# EAGLE schematic Dual_Half_Bridge_With_LDO_Regulator_DRV8850 (EAGLE 6.6.0)
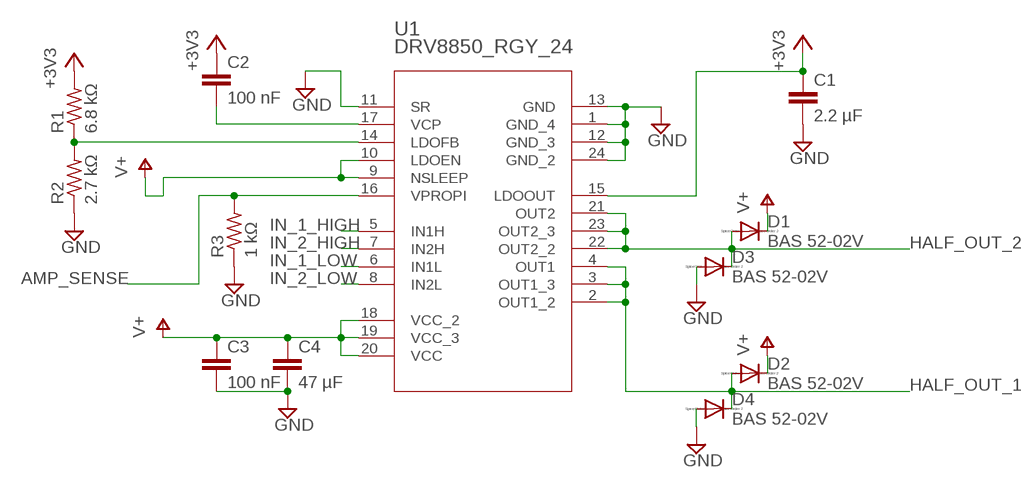
[diagram p0: schematic, sheet 1]

## Parts
C1  2.2 µF  C-EUC0603  [C0603]
C2  100 nF  C-EUC0402  [C0402]
C3  100 nF  C-EUC0402  [C0402]
C4  47 µF  C-EUC0805  [C0805]
D1  BAS 52-02V  DIODE-SOD523  [SOD523]
D2  BAS 52-02V  DIODE-SOD523  [SOD523]
D3  BAS 52-02V  DIODE-SOD523  [SOD523]
D4  BAS 52-02V  DIODE-SOD523  [SOD523]
R1  6.8 kΩ  R-US_R0402  [R0402]
R2  2.7 kΩ  R-US_R0402  [R0402]
R3  1 kΩ  R-US_R0402  [R0402]
U1  DRV8850_RGY_24  [RGY_24]

## Nets
+3V3: C1.1 C2.1 R1.2 U1.15(LDOOUT)
AMP_SENSE: R3.2 U1.16(VPROPI)
GND: C1.2 C3.2 C4.2 D3.A D4.A R2.1 R3.1 U1.1(GND_4) U1.11(SR) U1.12(GND_3) U1.13(GND) U1.24(GND_2)
HALF_OUT_1: D2.A D4.C U1.2(OUT1_2) U1.3(OUT1_3) U1.4(OUT1)
HALF_OUT_2: D1.A D3.C U1.21(OUT2) U1.22(OUT2_2) U1.23(OUT2_3)
IN_1_HIGH: U1.5(IN1H)
IN_1_LOW: U1.6(IN1L)
IN_2_HIGH: U1.7(IN2H)
IN_2_LOW: U1.8(IN2L)
N$1: R1.1 R2.2 U1.14(LDOFB)
N$7: C2.2 U1.17(VCP)
V+: C3.1 C4.1 D1.C D2.C U1.9(NSLEEP) U1.10(LDOEN) U1.18(VCC_2) U1.19(VCC_3) U1.20(VCC)

## Library data of the parts
C1-C4 = rcl:C-EU: CAPACITOR, European symbol
D1-D4 = diode:DIODE-: DIODE
R1-R3 = rcl:R-US_: RESISTOR, American symbol
U1 = block_parts:DRV8850_RGY_24: The DRV8850 from Texas Instruments is a Low-Voltage H-bridge IC With LDO Voltage Regulation.; MANUFACTURER_PART_NUMBER: drv8850_rgy_24; VENDOR: Texas Instruments